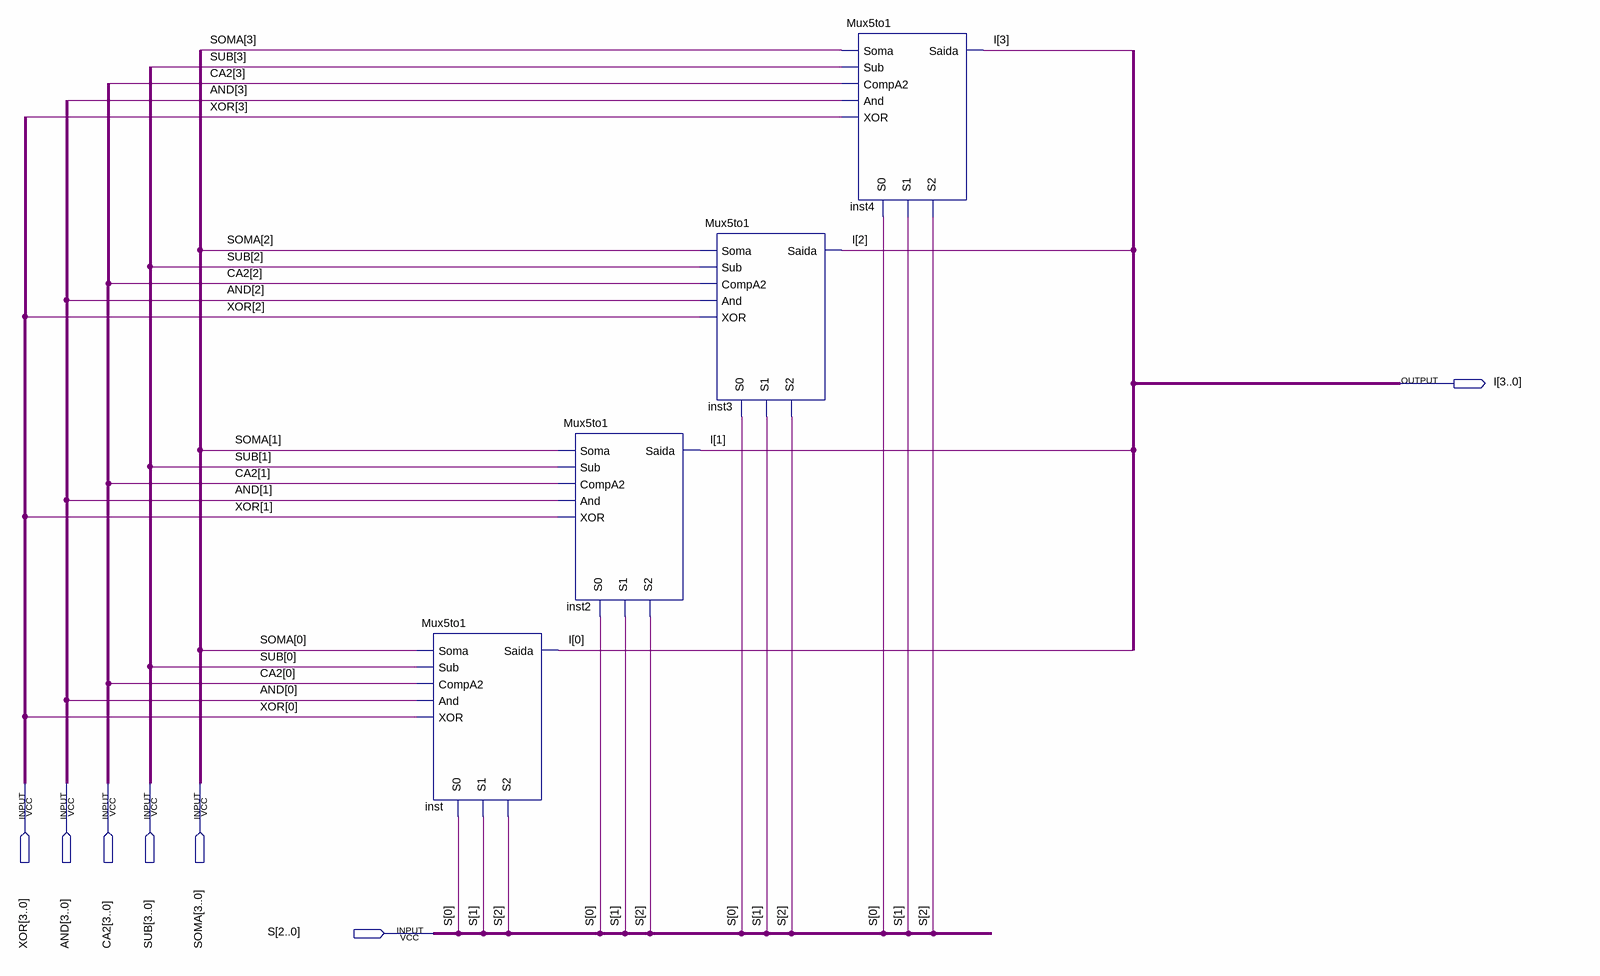
[diagram p0: schematic sheet]
// Quartus schematic AnotherMux.bdf as structural Verilog: 4 symbols, 7 pins
module AnotherMux (
  input  [3:0] XOR,
  input  [3:0] AND,
  input  [3:0] CA2,
  input  [3:0] SUB,
  input  [3:0] SOMA,
  input  [2:0] S,
  output [3:0] I
);

  Mux5to1 inst (
    .Soma(SOMA[0]), .Sub(SUB[0]), .CompA2(CA2[0]), .And(AND[0]), .XOR(XOR[0]), .S0(S[0]), .S1(S[1]),
    .S2(S[2]), .Saida(I[0]));
  Mux5to1 inst2 (
    .Soma(SOMA[1]), .Sub(SUB[1]), .CompA2(CA2[1]), .And(AND[1]), .XOR(XOR[1]), .S0(S[0]), .S1(S[1]),
    .S2(S[2]), .Saida(I[1]));
  Mux5to1 inst3 (
    .Soma(SOMA[2]), .Sub(SUB[2]), .CompA2(CA2[2]), .And(AND[2]), .XOR(XOR[2]), .S0(S[0]), .S1(S[1]),
    .S2(S[2]), .Saida(I[2]));
  Mux5to1 inst4 (
    .Soma(SOMA[3]), .Sub(SUB[3]), .CompA2(CA2[3]), .And(AND[3]), .XOR(XOR[3]), .S0(S[0]), .S1(S[1]),
    .S2(S[2]), .Saida(I[3]));
endmodule
